# Altium project 5.5_MIPI_LCD.PrjPcb
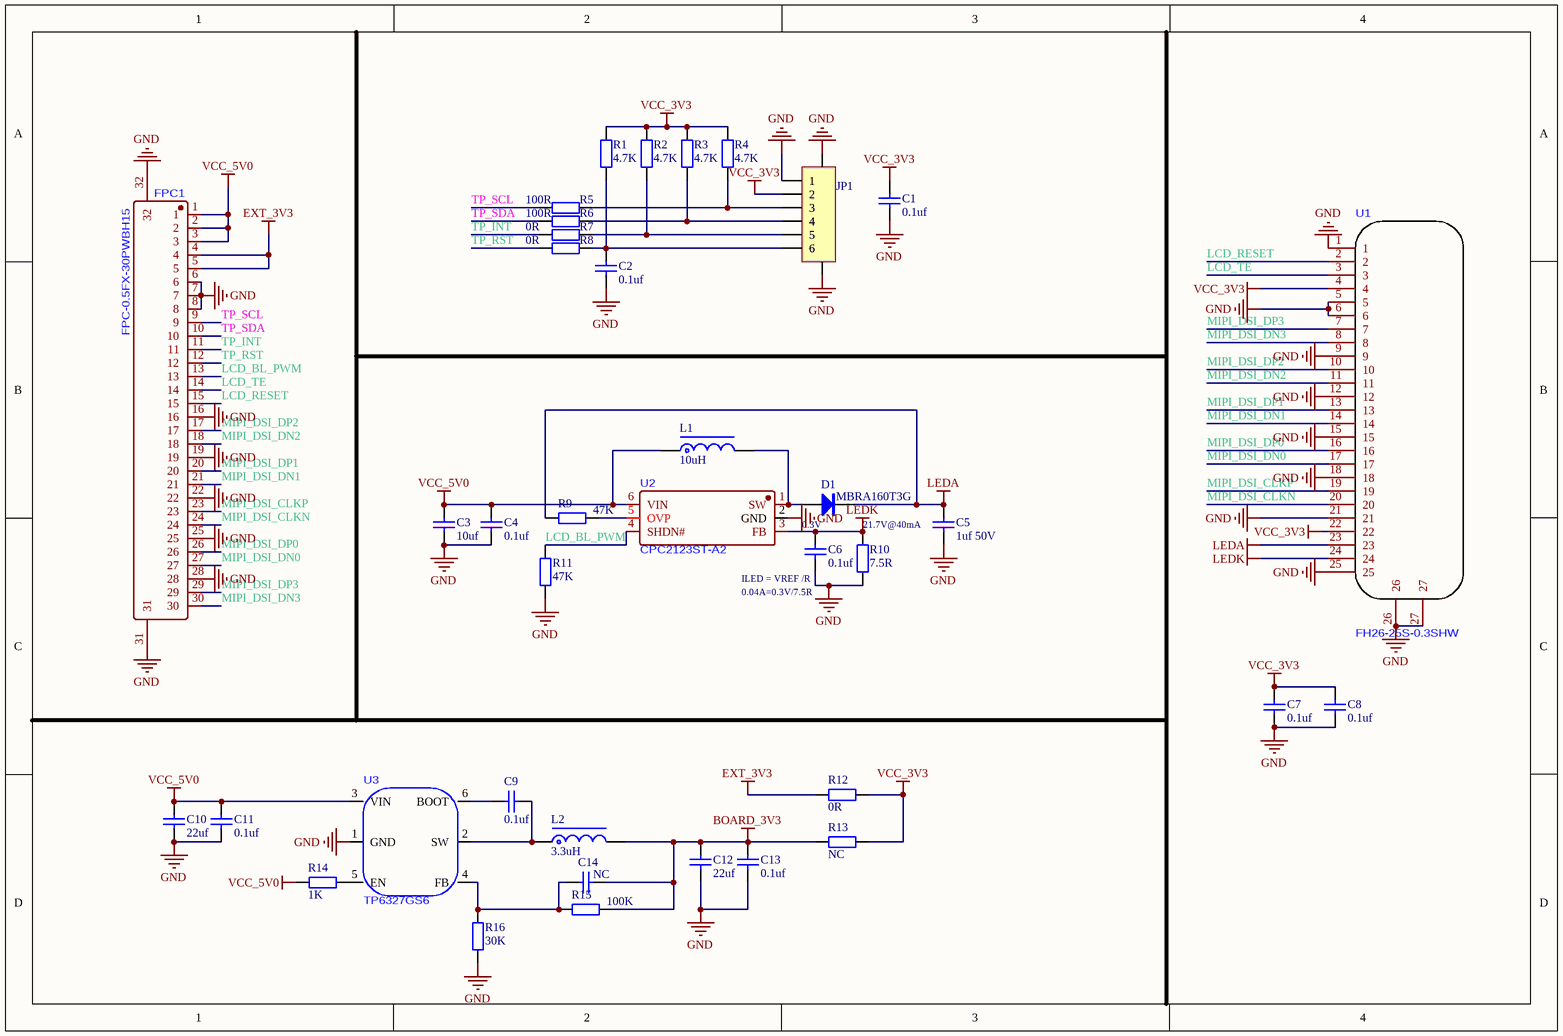
[diagram p0: Sheet1.SchDoc]
1 sheet, 38 parts. Net scope: global (net labels, ports and power ports of the same name join across sheets).
Board file: PCB1.PcbDoc

## Sheet Sheet1.SchDoc
size A4; SheetNumber: 1; SheetTotal: 1

### Parts
C1  0.1uf  [C0402_L]
C2  0.1uf  [C0402_L]
C3  10uf  [C0402_L]
C4  0.1uf  [C0402_L]
C5  1uf 50V  [C0603_L]
C6  0.1uf  [C0402_L]
C7  0.1uf  [C0402_L]
C8  0.1uf  [C0402_L]
C9  0.1uf  [C0402_L]
C10  22uf  [C0603_L]
C11  0.1uf  [C0402_L]
C12  22uf  [C0603_L]
C13  0.1uf  [C0402_L]
C14  NC  [C0402_L]
D1  MBRA160T3G  [SMA]
FPC1  FPC-0.5FX-30PWBH15  [FPC-SMD_30P-P0.50_FPC-0.5FX-30PWBH15]
JP1  CON-6P  [FPC0.5-WT-6P]  (value not drawn)
L1  10uH  [L-SMD-0420]
L2  3.3uH  [L-SMD-0420]
R1  4.7K  [R0402_L]
R2  4.7K  [R0402_L]
R3  4.7K  [R0402_L]
R4  4.7K  [R0402_L]
R5  100R  [R0402_L]
R6  100R  [R0402_L]
R7  0R  [R0402_L]
R8  0R  [R0402_L]
R9  47K  [R0402_L]
R10  7.5R  [R0603_L]
R11  47K  [R0402_L]
R12  0R  [R0603_L]
R13  NC  [R0603_L]
R14  1K  [R0402_L]
R15  100K  [R0402_L]
R16  30K  [R0402_L]
U1  FH26-25S-0.3SHW  [CONN-25PIN-FH26-25S-0.3SHW]
U2  CPC2123ST-A2  [SOT-23-6_L2.9-W1.6-P0.95-LS2.8-BR]
U3  TP6327GS6  [SOT23_6]

### Nets
BOARD_3V3: C12.2 C13.2 C14.1 L2.2 R13.1 R15.1
EXT_3V3: FPC1.4 FPC1.5 R12.1
GND: C1.1 C2.1 C3.1 C4.1 C5.1 C6.1 C7.1 C8.1 C10.1 C11.1 C12.1 C13.1 FPC1.6 FPC1.7 FPC1.8 FPC1.16 FPC1.19 FPC1.22 FPC1.25 FPC1.28 FPC1.31 FPC1.32 JP1.0 JP1.1 R10.1 R11.1 R16.2 U1.1 U1.5 U1.6 U1.9 U1.12 U1.15 U1.18 U1.21 U1.25 U1.26 U1.27 U2.2(GND) U3.1(GND)
LEDA: C5.2 D1.2(K) R9.2 U1.23
LEDK: C6.2 R10.2 U1.24 U2.3(FB)
VCC_3V3: C1.2 C7.2 C8.2 JP1.2 R1.2 R2.2 R3.2 R4.2 R12.2 R13.2 U1.4 U1.22
VCC_5V0: C3.2 C4.2 C10.2 C11.2 FPC1.1 FPC1.2 FPC1.3 L1.1 R14.2 U2.6(VIN) U3.3(VIN)
LCD_BL_PWM: FPC1.13 R11.2 U2.4(SHDN#)
LCD_RESET: FPC1.15 U1.2
LCD_TE: FPC1.14 U1.3
MIPI_DSI_CLKN: FPC1.24 U1.20
MIPI_DSI_CLKP: FPC1.23 U1.19
MIPI_DSI_DN0: FPC1.27 U1.17
MIPI_DSI_DN1: FPC1.21 U1.14
MIPI_DSI_DN2: FPC1.18 U1.11
MIPI_DSI_DN3: FPC1.30 U1.8
MIPI_DSI_DP0: FPC1.26 U1.16
MIPI_DSI_DP1: FPC1.20 U1.13
MIPI_DSI_DP2: FPC1.17 U1.10
MIPI_DSI_DP3: FPC1.29 U1.7
TP_INT: FPC1.11 R7.1
TP_RST: FPC1.12 R8.1
TP_SCL: FPC1.9 R5.1
TP_SDA: FPC1.10 R6.1
NetC2_2: C2.2 JP1.6 R1.1 R8.2
NetC9_1: C9.1 L2.1 U3.2(SW)
NetC9_2: C9.2 U3.6(BOOT)
NetC14_2: C14.2 R15.2 R16.1 U3.4(FB)
NetD1_1: D1.1(A) L1.2 U2.1(SW)
NetJP1_3: JP1.3 R4.1 R5.2
NetJP1_4: JP1.4 R3.1 R6.2
NetJP1_5: JP1.5 R2.1 R7.2
NetR9_1: R9.1 U2.5(OVP)
NetR14_1: R14.1 U3.5(EN)

### Notes on the sheet
- (near C6) ILED = VREF /R
- 0.3V
- (near R10) 21.7V@40mA
- (near C6) 0.04A=0.3V/7.5R

### Library data of the parts
C1-C14 = C: 贴片电容/MLCC电容
D1 = M7: 整流二极管
JP1 = Header 6: 6P连接器
L1 L2 = L-Molding Choke: 一体成型电感
R1-R16 = R: 贴片电阻